# Altium schematic sheet [2]- Power Budget.SchDoc
size A4; DocumentNumber: 2; SheetNumber: 2; SheetTotal: 11
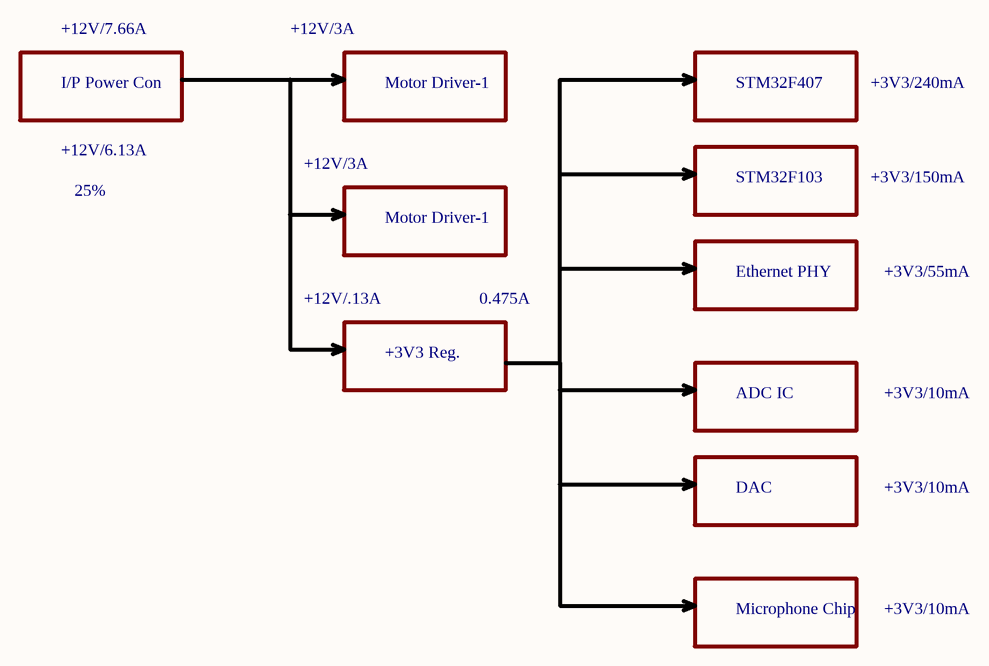
[diagram p0: [2]- Power Budget.SchDoc]

## Notes on the sheet
- +12V/7.66A
- +12V/3A
- I/P Power Con
- Motor Driver-1
- STM32F407
- +3V3/240mA
- +12V/6.13A
- 25%
- STM32F103
- +3V3/150mA
- Ethernet PHY
- +3V3/55mA
- +12V/.13A
- 0.475A
- +3V3 Reg.
- ADC IC
- +3V3/10mA
- DAC
- Microphone Chip